# Altium schematic sheet pulser.SchDoc: Main
size 379 x 240 mm; Engineer: B. Buck; Revision: -; SheetNumber: 1; SheetTotal: 1
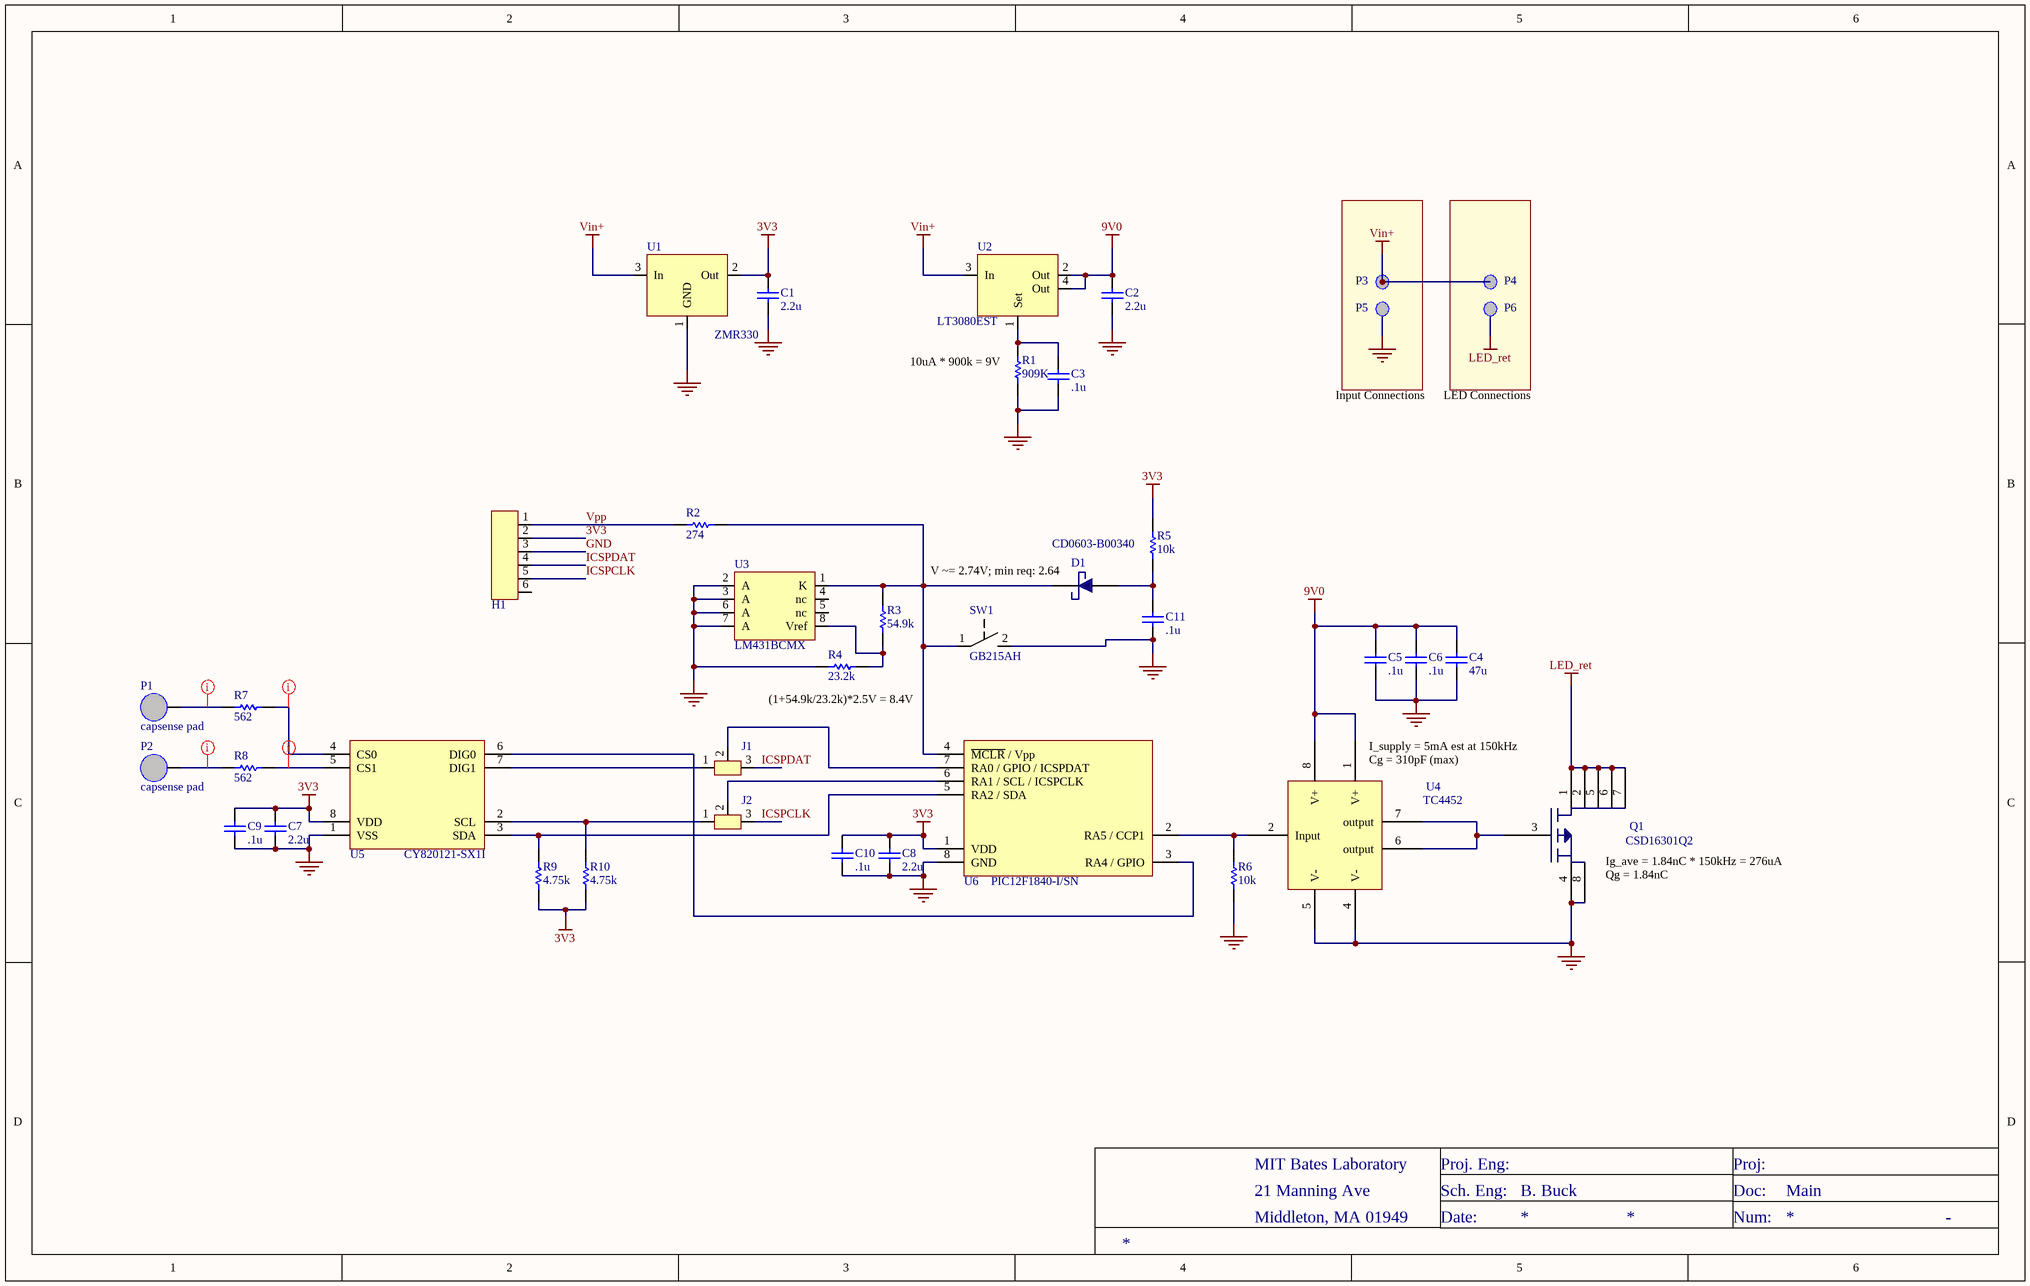
[diagram p0: pulser.SchDoc]

## Parts
C1  value 2.2u  [SMD1210]  (hidden comment: Cap)
C2  value 2.2u  [SMD1210]  (hidden comment: Cap)
C3  value .1u  [SMD0603]  (hidden comment: Cap)
C4  value 47u  [SMD1812]  (hidden comment: Cap)
C5  value .1u  [SMD0603]  (hidden comment: Cap)
C6  value .1u  [SMD0603]  (hidden comment: Cap)
C7  value 2.2u  [SMD1210]  (hidden comment: Cap)
C8  value 2.2u  [SMD1210]  (hidden comment: Cap)
C9  value .1u  [SMD0603]  (hidden comment: Cap)
C10  value .1u  [SMD0603]  (hidden comment: Cap)
C11  value .1u  [SMD0603]  (hidden comment: Cap)
D1  CD0603-B00340  [SMD0603 Polarized]
H1  6 pin header  [6 pin header]  (value not drawn)  (no BOM)
J1  jumper  [3 PIN HEADER]  (value not drawn)  (no BOM)
J2  jumper  [3 PIN HEADER]  (value not drawn)  (no BOM)
P1  capsense pad  [capsense 1cm]  (net tie, no BOM)
P2  capsense pad  [capsense 1cm]  (net tie, no BOM)
P3  16AWG Solder Point  [16 AWG Solder Point]  (value not drawn)  (net tie, no BOM)
P4  16AWG Solder Point  [16 AWG Solder Point]  (value not drawn)  (net tie, no BOM)
P5  16AWG Solder Point  [16 AWG Solder Point]  (value not drawn)  (net tie, no BOM)
P6  16AWG Solder Point  [16 AWG Solder Point]  (value not drawn)  (net tie, no BOM)
Q1  CSD16301Q2  [CSD16301Q2]
R1  value 909K  [SMD0603]  (hidden comment: Res)
R2  value 274  [SMD0603]  (hidden comment: Res)
R3  value 54.9k  [SMD0603]  (hidden comment: Res)
R4  value 23.2k  [SMD0603]  (hidden comment: Res)
R5  value 10k  [SMD0603]  (hidden comment: Res)
R6  value 10k  [SMD0603]  (hidden comment: Res)
R7  value 562  [SMD0603]  (hidden comment: Res)
R8  value 562  [SMD0603]  (hidden comment: Res)
R9  value 4.75k  [SMD0603]  (hidden comment: Res)
R10  value 4.75k  [SMD0603]  (hidden comment: Res)
SW1  GB215AH  [GB215AH]
U1  ZMR330  [SOT23 - Diodes]
U2  LT3080EST  [SOT233]
U3  LM431BCMX  [8 PIN SOIC]
U4  TC4452  [8 PIN SOIC]
U5  CY820121-SX1I  [8 PIN SOIC]
U6  PIC12F1840-I/SN  [8 PIN SOIC]

## Nets
3V3: C1.2 C7.2 C8.2 C9.2 C10.2 H1.2 R5.1 R9.2 R10.2 U1.2(Out) U5.8(VDD) U6.1(VDD)
9V0: C2.2 C4.2 C5.2 C6.2 U2.2(Out) U2.4(Out) U4.1(V+) U4.8(V+)
GND: C1.1 C2.1 C3.1 C4.1 C5.1 C6.1 C7.1 C8.1 C9.1 C10.1 C11.1 H1.3 P5.1 Q1.4 Q1.8 R1.1 R4.2 R6.2 SW1.2 U1.1(GND) U3.2(A) U3.3(A) U3.6(A) U3.7(A) U4.4(V-) U4.5(V-) U5.1(VSS) U6.8(GND)
LED_ret: P6.1 Q1.1 Q1.2 Q1.5 Q1.6 Q1.7
Vin+: P3.1 P4.1 U1.3(In) U2.3(In)
ICSPCLK: H1.5 J2.3
ICSPDAT: H1.4 J1.3
Vpp: H1.1 R2.2
NetC3_2: C3.2 R1.2 U2.1(Set)
NetC11_2: C11.2 D1.2(A) R5.2
NetD1_1: D1.1(K) R2.1 R3.2 SW1.1 U3.1(K) U6.4(~{MCLR}_/_Vpp)
NetJ1_1: J1.1 U5.7(DIG1)
NetJ1_2: J1.2 U6.7(RA0_/_GPIO_/_ICSPDAT)
NetJ2_1: J2.1 R10.1 U5.2(SCL)
NetJ2_2: J2.2 U6.6(RA1_/_SCL_/_ICSPCLK)
NetP1_1: P1.1 R7.2
NetP2_1: P2.1 R8.2
NetQ1_3: Q1.3 U4.6(output) U4.7(output)
NetR3_1: R3.1 R4.1 U3.8(Vref)
NetR6_1: R6.1 U4.2(Input) U6.2(RA5_/_CCP1)
NetR7_1: R7.1 U5.4(CS0)
NetR8_1: R8.1 U5.5(CS1)
NetR9_1: R9.1 U5.3(SDA) U6.5(RA2_/_SDA)
NetU5_6: U5.6(DIG0) U6.3(RA4_/_GPIO)

Not connected (* = marked no-connect by the designer): H1 6; U3 4(nc) 5(nc)

## Layout directives
net class capsense: NetP1_1, NetP2_1, NetR7_1, NetR8_1

## Notes on the sheet
- (near R1) 10uA * 900k = 9V
- Input Connections
- LED Connections
- (near D1) V ~= 2.74V; min req: 2.64
- (near R4) (1+54.9k/23.2k)*2.5V = 8.4V
- (near U4) Cg = 310pF (max)
- (near U4) I_supply = 5mA est at 150kHz
- (near Q1) Qg = 1.84nC
- (near Q1) Ig_ave = 1.84nC * 150kHz = 276uA
- MIT Bates Laboratory
- Proj. Eng:
- Proj:
- 21 Manning Ave
- Middleton, MA 01949
- Sch. Eng:
- Date:
- Doc:
- Num:

## Library data of the parts
C1 C2 C7 C8 = Cap: Capacitor; PartNumber: C1210C225K5RAC; Manufacturer: Kemet
C3 C5 C6 C9-C11 = Cap: Capacitor; PartNumber: 250R14W104KV4T; Manufacturer: Johanson Dielectrics
C4 = Cap: Capacitor; PartNumber: C1812C475K5RAC; Manufacturer: Kemet
D1 = CD0603-B00340: Schottky Diode; Manufacturer: Bourns; PartNumber: CD0603-B00340
J1 J2 = jumper: Three Pin Jumper
P1 P2 = capsense pad 1: circular capsense pad
Q1 = CSD16301Q2: N Ch. MOSFET; Manufacturer: Texas Instruments; PartNumber: CSD16301Q2
R1 = Res: Resistor; PartNumber: CRCW0603909KFK; Manufacturer: Vishay / Dale
R2 = Res: Resistor; PartNumber: CRCW0603274RFK; Manufacturer: Vishay / Dale
R3 = Res: Resistor; PartNumber: CRCW060354K9FK; Manufacturer: Vishay / Dale
R4 = Res: Resistor; PartNumber: CRCW060323K2FK; Manufacturer: Vishay / Dale
R5 R6 = Res: Resistor; PartNumber: CRCW060310K0FK; Manufacturer: Vishay / Dale
R7 R8 = Res: Resistor; PartNumber: CRCW0603562RFK; Manufacturer: Vishay / Dale
R9 R10 = Res: Resistor; PartNumber: CRCW06034K75FK; Manufacturer: Vishay / Dale
SW1 = GB215AH: SPST Normally Open Switch; PartNumber: GB125AH; Manufacturer: NKK Switches
U1 = ZMR330: Diodes 3.3V LDO regulator, 50mA; PartNumber: ZMR330FTA; Manufacturer: Diodes
U2 = LT3080EST: Adjustable Regulator, SOT-223 Package; Manufacturer: Linear Technologies; PartNumber: LT3080EST
U3 = LM431BCMX: Adjustable Voltage Reference; Manufacturer: Fairchild Semiconductor; PartNumber: LM431ACMX
U4 = TC4452: MOSFET Gate Driver, Low Side, Non Inverting 13A max; Manufacturer: Microchip; PartNumber: TC4452VOA
U5 = CY820121-SX1I: Capsense Module, 2 button; PartNumber: CY8C20121-SX1IX; Manufacturer: Cypress
U6 = PIC12F1840-I/SN: 8 Bit RISC uController; Manufacturer: Microchip; PartNumber: PIC12F1840-I/SN